# EAGLE design PATA Breakout Sequencer (EAGLE 9.3.1)
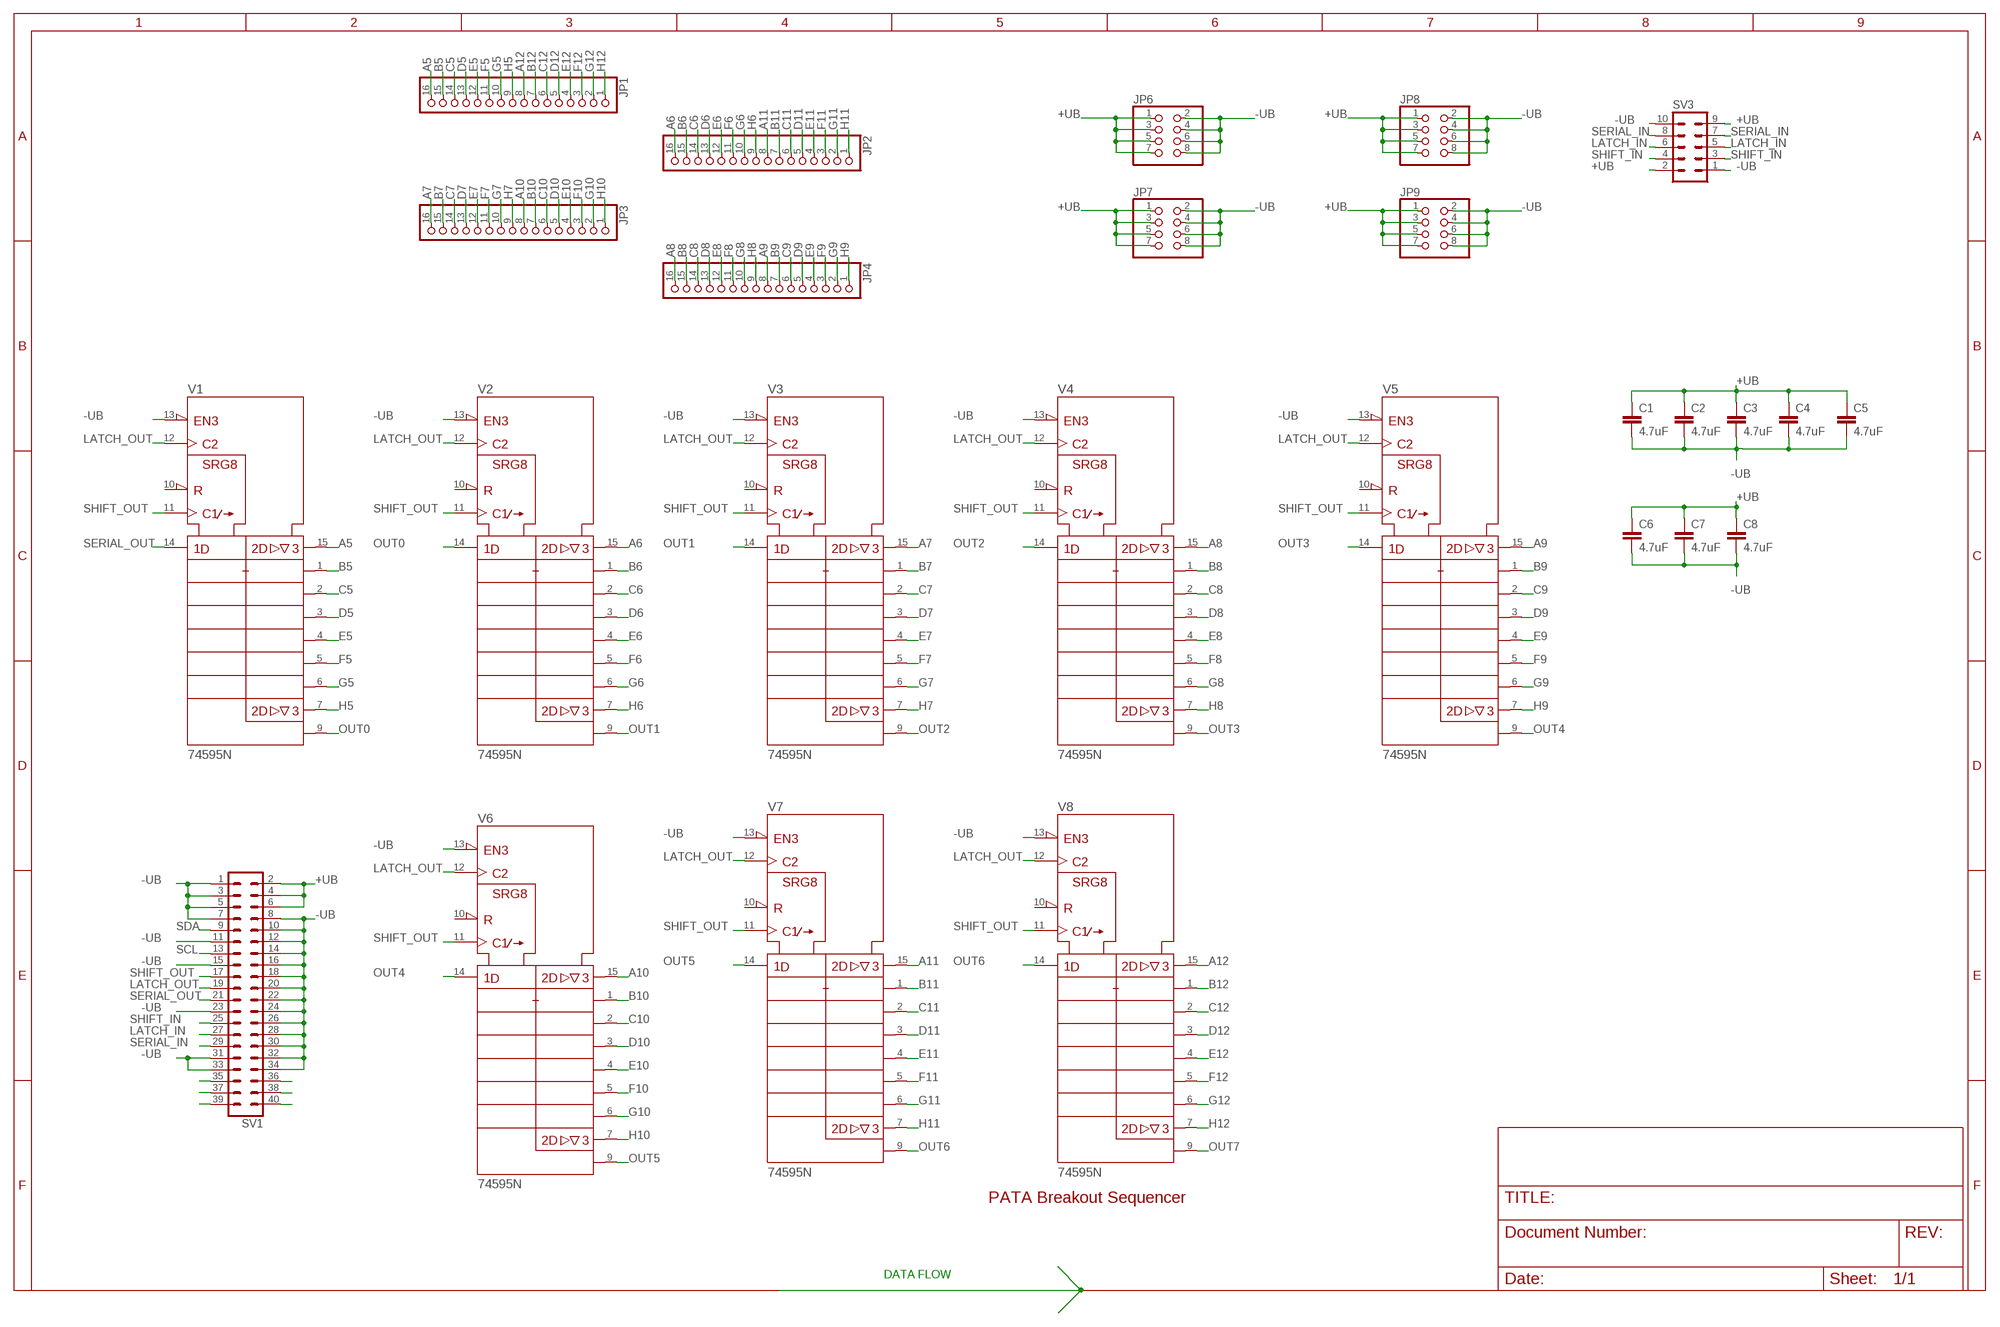
[diagram p0: schematic, sheet 1]

## Parts
C1  4.7uF  C-EU050-024X044  [C050-024X044]
C2  4.7uF  C-EU050-024X044  [C050-024X044]
C3  4.7uF  C-EU050-024X044  [C050-024X044]
C4  4.7uF  C-EU050-024X044  [C050-024X044]
C5  4.7uF  C-EU050-024X044  [C050-024X044]
C6  4.7uF  C-EU050-024X044  [C050-024X044]
C7  4.7uF  C-EU050-024X044  [C050-024X044]
C8  4.7uF  C-EU050-024X044  [C050-024X044]
JP1  PINHD-1X16  [1X16]
JP2  PINHD-1X16  [1X16]
JP3  PINHD-1X16  [1X16]
JP4  PINHD-1X16  [1X16]
JP6  PINHD-2X4  [2X04]
JP7  PINHD-2X4  [2X04]
JP8  PINHD-2X4  [2X04]
JP9  PINHD-2X4  [2X04]
SV1  MA20-2  [MA20-2]
SV3  MA05-2  [MA05-2]
V1  74595N  [DIL16]
V2  74595N  [DIL16]
V3  74595N  [DIL16]
V4  74595N  [DIL16]
V5  74595N  [DIL16]
V6  74595N  [DIL16]
V7  74595N  [DIL16]
V8  74595N  [DIL16]

## Nets
+UB: C1.1 C2.1 C3.1 C4.1 C5.1 C6.1 C7.1 C8.1 JP6.1 JP6.3 JP6.5 JP6.7 JP7.1 JP7.3 JP7.5 JP7.7 JP8.1 JP8.3 JP8.5 JP8.7 JP9.1 JP9.3 JP9.5 JP9.7 SV1.2 SV1.4 SV1.6 SV3.2 SV3.9
-UB: C1.2 C2.2 C3.2 C4.2 C5.2 C6.2 C7.2 C8.2 JP6.2 JP6.4 JP6.6 JP6.8 JP7.2 JP7.4 JP7.6 JP7.8 JP8.2 JP8.4 JP8.6 JP8.8 JP9.2 JP9.4 JP9.6 JP9.8 SV1.1 SV1.3 SV1.5 SV1.7 SV1.8 SV1.10 SV1.11 SV1.12 SV1.14 SV1.15 SV1.16 SV1.18 SV1.20 SV1.22 SV1.23 SV1.24 SV1.26 SV1.28 SV1.30 SV1.31 SV1.32 SV1.33 SV1.34 SV3.1 SV3.10 V1.13(!G) V2.13(!G) V3.13(!G) V4.13(!G) V5.13(!G) V6.13(!G) V7.13(!G) V8.13(!G)
A5: JP1.16 V1.15(QA)
A6: JP2.16 V2.15(QA)
A7: JP3.16 V3.15(QA)
A8: JP4.16 V4.15(QA)
A9: JP4.8 V5.15(QA)
A10: JP3.8 V6.15(QA)
A11: JP2.8 V7.15(QA)
A12: JP1.8 V8.15(QA)
B5: JP1.15 V1.1(QB)
B6: JP2.15 V2.1(QB)
B7: JP3.15 V3.1(QB)
B8: JP4.15 V4.1(QB)
B9: JP4.7 V5.1(QB)
B10: JP3.7 V6.1(QB)
B11: JP2.7 V7.1(QB)
B12: JP1.7 V8.1(QB)
C5: JP1.14 V1.2(QC)
C6: JP2.14 V2.2(QC)
C7: JP3.14 V3.2(QC)
C8: JP4.14 V4.2(QC)
C9: JP4.6 V5.2(QC)
C10: JP3.6 V6.2(QC)
C11: JP2.6 V7.2(QC)
C12: JP1.6 V8.2(QC)
D5: JP1.13 V1.3(QD)
D6: JP2.13 V2.3(QD)
D7: JP3.13 V3.3(QD)
D8: JP4.13 V4.3(QD)
D9: JP4.5 V5.3(QD)
D10: JP3.5 V6.3(QD)
D11: JP2.5 V7.3(QD)
D12: JP1.5 V8.3(QD)
E5: JP1.12 V1.4(QE)
E6: JP2.12 V2.4(QE)
E7: JP3.12 V3.4(QE)
E8: JP4.12 V4.4(QE)
E9: JP4.4 V5.4(QE)
E10: JP3.4 V6.4(QE)
E11: JP2.4 V7.4(QE)
E12: JP1.4 V8.4(QE)
F5: JP1.11 V1.5(QF)
F6: JP2.11 V2.5(QF)
F7: JP3.11 V3.5(QF)
F8: JP4.11 V4.5(QF)
F9: JP4.3 V5.5(QF)
F10: JP3.3 V6.5(QF)
F11: JP2.3 V7.5(QF)
F12: JP1.3 V8.5(QF)
G5: JP1.10 V1.6(QG)
G6: JP2.10 V2.6(QG)
G7: JP3.10 V3.6(QG)
G8: JP4.10 V4.6(QG)
G9: JP4.2 V5.6(QG)
G10: JP3.2 V6.6(QG)
G11: JP2.2 V7.6(QG)
G12: JP1.2 V8.6(QG)
H5: JP1.9 V1.7(QH)
H6: JP2.9 V2.7(QH)
H7: JP3.9 V3.7(QH)
H8: JP4.9 V4.7(QH)
H9: JP4.1 V5.7(QH)
H10: JP3.1 V6.7(QH)
H11: JP2.1 V7.7(QH)
H12: JP1.1 V8.7(QH)
LATCH_IN: SV1.27 SV3.5 SV3.6
LATCH_OUT: SV1.19 V1.12(RCK) V2.12(RCK) V3.12(RCK) V4.12(RCK) V5.12(RCK) V6.12(RCK) V7.12(RCK) V8.12(RCK)
N$18: SV1.35
N$19: SV1.37
N$20: SV1.39
N$38: SV1.36
N$39: SV1.38
N$40: SV1.40
OUT0: V1.9(QH*) V2.14(SER)
OUT1: V2.9(QH*) V3.14(SER)
OUT2: V3.9(QH*) V4.14(SER)
OUT3: V4.9(QH*) V5.14(SER)
OUT4: V5.9(QH*) V6.14(SER)
OUT5: V6.9(QH*) V7.14(SER)
OUT6: V7.9(QH*) V8.14(SER)
OUT7: V8.9(QH*)
SCL: SV1.13
SDA: SV1.9
SERIAL_IN: SV1.29 SV3.7 SV3.8
SERIAL_OUT: SV1.21 V1.14(SER)
SHIFT_IN: SV1.25 SV3.3 SV3.4
SHIFT_OUT: SV1.17 V1.11(SRCK) V2.11(SRCK) V3.11(SRCK) V4.11(SRCK) V5.11(SRCK) V6.11(SRCK) V7.11(SRCK) V8.11(SRCK)
Unconnected: V1.10(!SRCLR) V2.10(!SRCLR) V3.10(!SRCLR) V4.10(!SRCLR) V5.10(!SRCLR) V6.10(!SRCLR) V7.10(!SRCLR) V8.10(!SRCLR)

## Notes on the sheet
- DATA FLOW

## Power pins joined to a net without a drawn wire
+UB: V1.16(+UB) V2.16(+UB) V3.16(+UB) V4.16(+UB) V5.16(+UB) V6.16(+UB) V7.16(+UB) V8.16(+UB)
-UB: V1.8(-UB) V2.8(-UB) V3.8(-UB) V4.8(-UB) V5.8(-UB) V6.8(-UB) V7.8(-UB) V8.8(-UB)

## Library data of the parts
C1-C8 = rcl:C-EU: CAPACITOR, European symbol; SPICEPREFIX: C
JP1-JP4 = pinhead:PINHD-1X16: PIN HEADER
JP6-JP9 = pinhead:PINHD-2X4: PIN HEADER
SV1 = con-lstb:MA20-2: PIN HEADER; OC_FARNELL: unknown; OC_NEWARK: unknown
SV3 = con-lstb:MA05-2: PIN HEADER; OC_FARNELL: unknown; OC_NEWARK: unknown
V1-V8 = 74ttl-din:74*595: 8-bit SHIFT REGISTER, output latch

## Board
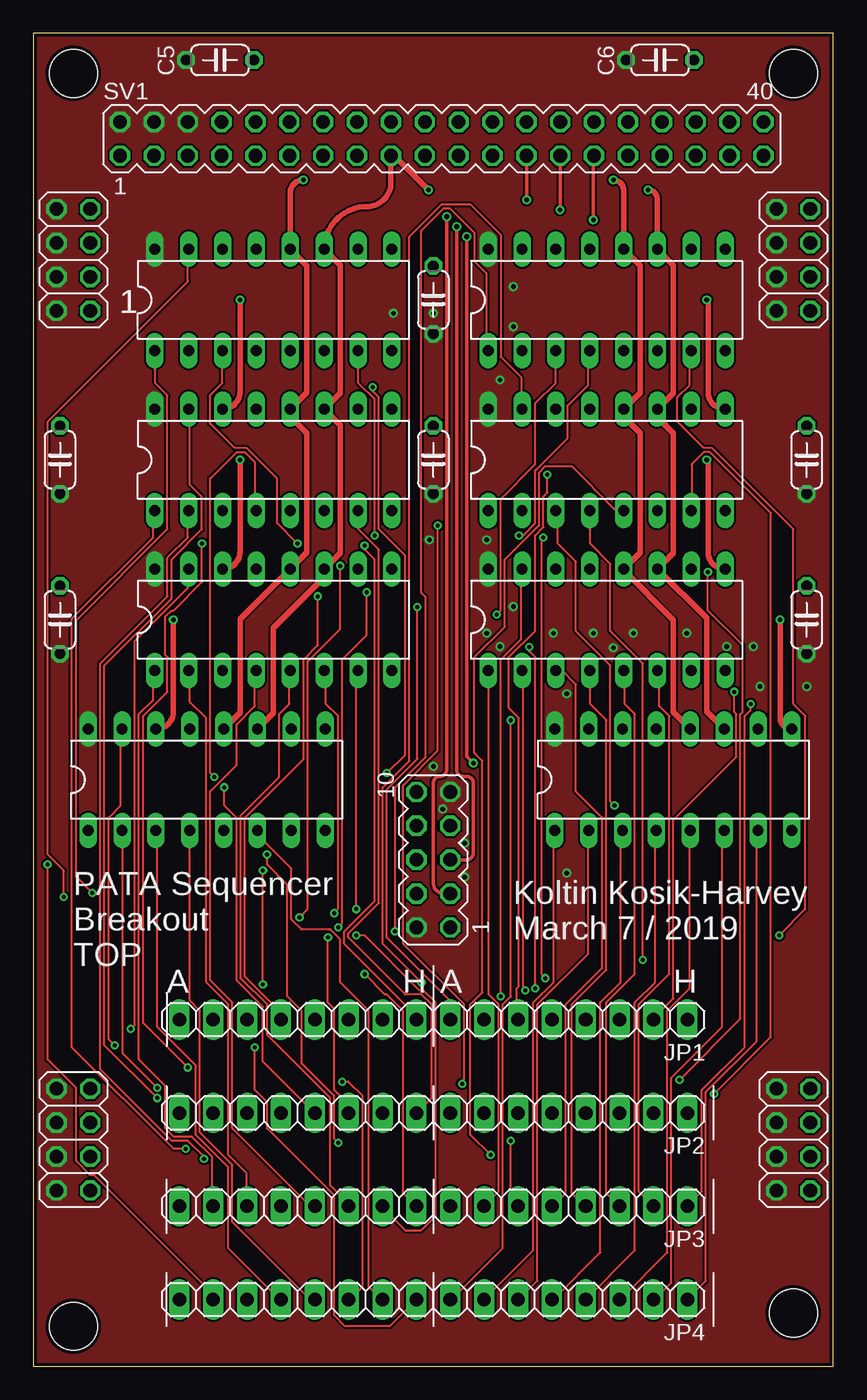
[diagram p1: board, top side]
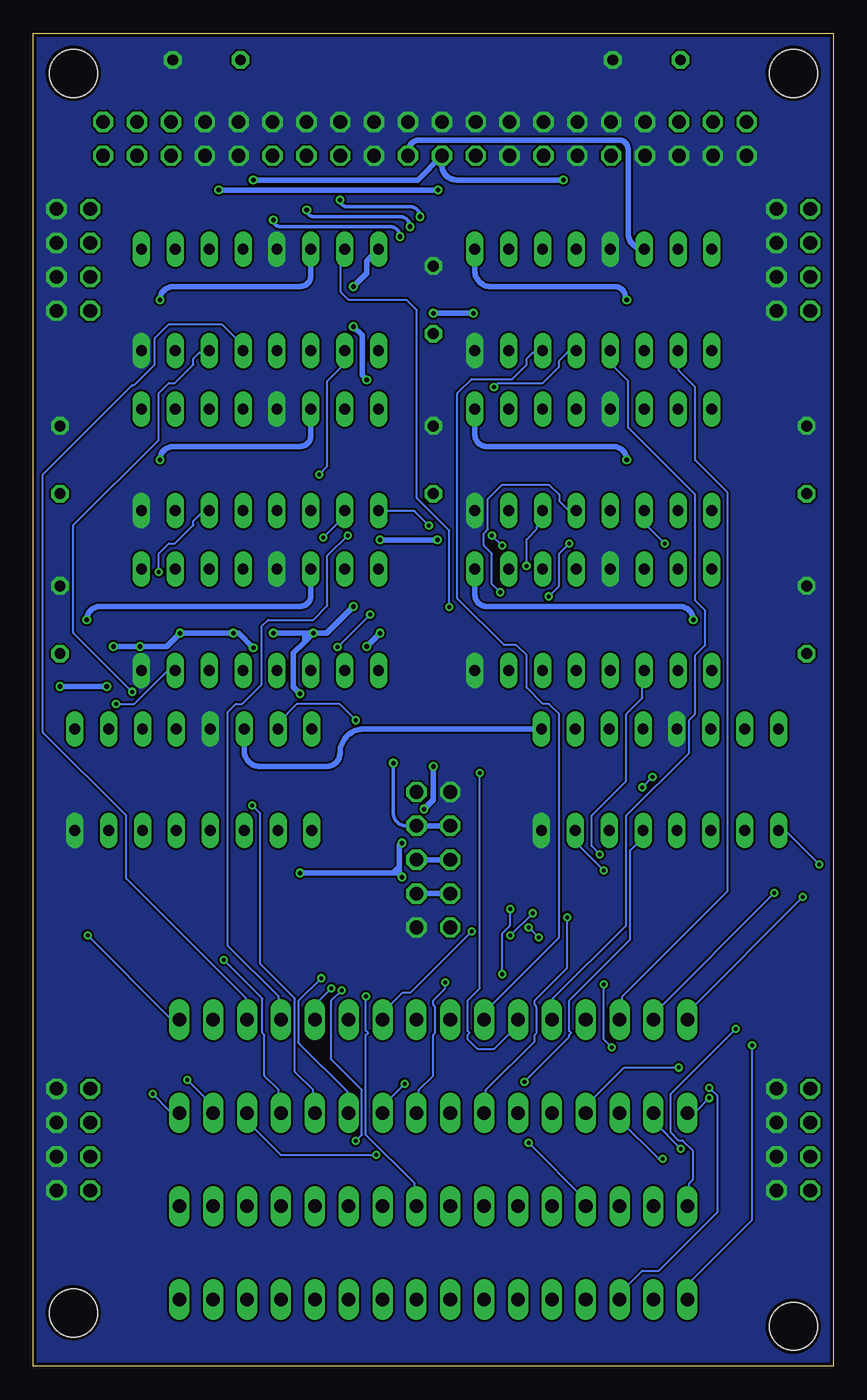
[diagram p2: board, bottom side, seen from below]

Size 60 x 100 mm. Coordinates in mm from the lower left corner, seen from the top.
Outline: 0,0 60,0 60,100 0,100 0,0
Copper layers (1*16): Top 0.035mm / dielectric 1.5mm / Bottom 0.035mm
Design rules "SeeedStudio_2layer_DRU_no_angle_20140221": minimum track width 6mil, minimum drill 12mil, track to track 6mil, track to pad 6mil, pad to pad 6mil, via to via 6mil, smd to smd 0mil, copper to edge 10mil, drill to drill 10mil, minimum pad ring 10mil, minimum via ring 6mil, stop-mask expansion 2mil, vias tented up to drill 100mil, thermal gap 10mil
Holes 3.6 mm at 3,97 3,3 57,4 57,97

### Footprints (pad centres in the part's own frame; a part is rotated, then mirrored left to right if it is on the bottom)
C050-024X044 = drill 0.813 octagon: 1 -2.54,0; 2 2.54,0
1X16 = drill 1.016 long: 1 -19.05,0; 2 -16.51,0; 3 -13.97,0; 4 -11.43,0; 5 -8.89,0; 6 -6.35,0; 7 -3.81,0; 8 -1.27,0; 9 1.27,0; 10 3.81,0; 11 6.35,0; 12 8.89,0; 13 11.43,0; 14 13.97,0; 15 16.51,0; 16 19.05,0
2X04 = drill 1.016 octagon: 1 -3.81,-1.27; 2 -3.81,1.27; 3 -1.27,-1.27; 4 -1.27,1.27; 5 1.27,-1.27; 6 1.27,1.27; 7 3.81,-1.27; 8 3.81,1.27
MA20-2 = drill 1.016 octagon: 1 -24.13,-1.27; 2 -24.13,1.27; 3 -21.59,-1.27; 4 -21.59,1.27; 5 -19.05,-1.27; 6 -19.05,1.27; 7 -16.51,-1.27; 8 -16.51,1.27; 9 -13.97,-1.27; 10 -13.97,1.27; 11 -11.43,-1.27; 12 -11.43,1.27; 13 -8.89,-1.27; 14 -8.89,1.27; 15 -6.35,-1.27; 16 -6.35,1.27; 17 -3.81,-1.27; 18 -3.81,1.27; 19 -1.27,-1.27; 20 -1.27,1.27; 21 1.27,-1.27; 22 1.27,1.27; 23 3.81,-1.27; 24 3.81,1.27; 25 6.35,-1.27; 26 6.35,1.27; 27 8.89,-1.27; 28 8.89,1.27; 29 11.43,-1.27; 30 11.43,1.27; 31 13.97,-1.27; 32 13.97,1.27; 33 16.51,-1.27; 34 16.51,1.27; 35 19.05,-1.27; 36 19.05,1.27; 37 21.59,-1.27; 38 21.59,1.27; 39 24.13,-1.27; 40 24.13,1.27
MA05-2 = drill 1.016 octagon: 1 -5.08,-1.27; 2 -5.08,1.27; 3 -2.54,-1.27; 4 -2.54,1.27; 5 0,-1.27; 6 0,1.27; 7 2.54,-1.27; 8 2.54,1.27; 9 5.08,-1.27; 10 5.08,1.27
DIL16 = drill 0.813 long: 1 -8.89,-3.81; 2 -6.35,-3.81; 3 -3.81,-3.81; 4 -1.27,-3.81; 5 1.27,-3.81; 6 3.81,-3.81; 7 6.35,-3.81; 8 8.89,-3.81; 9 8.89,3.81; 10 6.35,3.81; 11 3.81,3.81; 12 1.27,3.81; 13 -1.27,3.81; 14 -3.81,3.81; 15 -6.35,3.81; 16 -8.89,3.81

### Placement (x,y rotation side)
C1  2,68 90 top
C2  2,56 90 top
C3  58,68 90 top
C4  58,56 90 top
C5  14,98 0 top
C6  47,98 0 top
C7  30,80 90 top
C8  30,68 90 top
JP1  30,26 180 top
JP2  30,19 180 top
JP3  30,12 180 top
JP4  30,5 180 top
JP6  3,17 270 top
JP7  57,17 270 top
JP8  3,83 270 top
JP9  57,83 270 top
SV1  30.63,92.09 0 top
SV3  30,38 90 top
V1  18,80 0 top
V2  18,68 0 top
V3  18,56 0 top
V4  13,44 0 top
V5  48,44 0 top
V6  43,56 0 top
V7  43,68 0 top
V8  43,80 0 top

### Tracks (layer width: path | path; a pad name or v marks a point on that pad's centre or on a via)
+UB  (via drill 0.35)
  Bottom 0.406: v30,45 30,42.5 v30.7,41.8 | v27,79 v30,79 | v29.7,62 v34,62 | v34,55 v35,54 | v36,57 38,55 v39,55 | v35,74 35.35,74.35 35.35,77.35 v36,78 | V8.16 35,82.92 35,82 v36,81 | v40,50.45 40.5,50.95 40.5,53.5 39.65,54.35 | v39,55 39.65,54.35 | v39,55 39.65,55 | 39.65,55 v42,55 | 39.65,54.35 39.65,55 | v43.5,53.9 44.6,55 v45,55 v49,55 50,54 v52,54 v54,54 | v54.5,51 v58,51 | v32.35,39.25 32.4,39.25 32.54,39.11 32.54,37.45 | 32.54,37 32.54,37.45 | v40,37 33,37 | 33,37 32.54,37 | v32.35,36.7 32.54,36.89 32.54,37 | 33,37 32.55,37.45 32.54,37.45
  pour Top (no thermals): -2,102 62,102 62,-2 -2,-2
-UB
  pour Bottom (no thermals): -1,101 61,101 61,-1 -1,-1
A5  (via drill 0.3)
  Top 0.152: v2.29,35.2 2.29,37.19 1.07,38.41 1.07,70.87 11.58,81.38 11.58,83.67 V1.15
  Bottom 0.152: v2.29,35.2 10.82,26.67 10.82,26.06 JP1.16
A6  (via drill 0.3)
  Top 0.152: v9.3,20.12 5.33,24.08 5.33,52.58 10.36,57.61 10.36,60.5 12.65,62.79 12.65,65.23 11.73,66.14 11.73,71.78 V2.15
  Bottom 0.152: v9.3,20.12 10.36,19.05 10.82,19.05 JP2.16
A7  (via drill 0.3)
  Top 0.152: v7.32,25.3 7.62,25.6 7.62,54.41 11.58,58.37 11.58,59.74 V3.15
  Bottom 0.152: v7.32,25.3 12.19,20.42 12.19,17.53 11.58,16.92 11.28,16.92 10.52,16.15 10.52,14.02 10.82,13.72 10.82,12.04 JP3.16
A8  (via drill 0.3)
  Top 0.152: v6.1,24.08 5.64,24.54 5.64,41.15 6.55,42.06 6.55,47.7 V4.15
  Bottom 0.152: v6.1,24.08 6.1,10.97 10.82,6.25 10.82,5.03 JP4.16
A9  (via drill 0.3)
  Top 0.152: v35.81,48.46 35.81,27.74 35.2,27.13 35.2,8.84 31.39,5.03 JP4.8
  Bottom 0.152: v35.81,48.46 37.03,49.68 40.23,49.68 41.6,48.31 41.6,47.85 V5.15
A10  (via drill 0.3)
  Top 0.152: v35.05,27.74 35.05,53.03 36.58,54.56 36.58,59.74 V6.15
  Bottom 0.152: v35.05,27.74 35.05,25.15 34.9,24.99 35.05,24.84 35.05,17.37 31.39,13.72 31.39,12.04 JP3.8
A11  (via drill 0.3)
  Top 0.152: v29.11,28.8 26.21,31.7 26.21,43.43 28.19,45.41 28.19,84.73 30.63,87.17 32.77,87.17 35.05,84.89 35.05,75.74 36.58,74.22 36.58,71.93 V7.15
  Bottom 0.152: v29.11,28.8 29.11,28.35 30.02,27.43 30.02,27.13 29.87,26.98 29.87,24.99 30.02,24.84 30.02,21.79 31.09,20.73 31.09,19.2 31.24,19.05 JP2.8
A12  (via drill 0.3)
  Top 0.152: v28.8,56.97 28.8,45.57 26.52,43.28 26.52,32.16 31.24,27.43 31.24,26.06 JP1.8
  Bottom 0.152: v28.8,56.97 28.8,62.7 31.24,65.14 31.24,79.24 32,80 36.35,80 36.98,80.63 36.98,83.48 V8.15
B5  (via drill 0.3)
  Top 0.152: v4.42,35.51 3.2,36.73 3.2,55.93 10.06,62.79 10.06,72.85 9.14,73.76 9.14,76.05 V1.1
  Bottom 0.152: v4.42,35.51 13.41,26.52 13.41,26.06 JP1.15
B6  (via drill 0.3)
  Top 0.152: v11.43,16.31 10.52,16.31 2.9,23.93 2.9,56.08 8.99,62.18 8.99,64.16 V2.1
  Bottom 0.152: v11.43,16.31 13.41,18.29 13.41,18.9 JP2.15
B7
  Top 0.152: V3.1 8.99,52.12 8.99,49.99 7.92,48.92 7.92,23.01 9.91,21.03 9.91,17.83 10.52,17.22 11.89,17.22 13.41,15.7 13.41,12.04 JP3.15
B8  (via drill 0.3)
  Top 0.152: v1.07,37.64 1.07,23.01 3.2,20.88 3.2,15.39 4.27,14.33 4.57,14.33 13.41,5.49 13.41,5.03 JP4.15
  Bottom 0.152: v1.07,37.64 3.5,40.08 3.96,40.08 V4.1
B9
  Top 0.152: V5.1 39.01,40.08 39.01,28.8 37.49,27.28 37.49,8.69 33.83,5.03 JP4.7
B10
  Top 0.152: V6.1 34.14,52.12 34.14,27.89 34.9,27.13 34.9,13.11 33.83,12.04 JP3.7
B11  (via drill 0.3)
  Top 0.152: v30.33,63.06 30.33,46.18 27.74,43.59 27.74,31.7 32.31,27.13 32.31,21.34 v32.16,21.18
  Bottom 0.152: v30.33,63.06 31.43,64.16 33.98,64.16 V7.1 | v32.16,21.18 33.68,19.66 33.68,19.05 JP2.7
B12  (via drill 0.3)
  Top 0.152: v27.13,32.61 27.13,43.43 29.41,45.72 29.41,57.72 29.11,58.02 29.11,85.19 30.79,86.87 31.24,86.87 33.07,85.04 33.07,82.91 33.98,81.99 33.98,76.2 V8.1
  Bottom 0.152: v27.13,32.61 31.7,28.04 32.31,28.04 33.68,26.67 33.68,26.06 JP1.7
C5
  Bottom 0.152: V1.2 11.58,76.05 11.58,74.68 10.36,73.46 10.36,67.97 7.92,65.53 7.92,35.66 15.85,27.74 15.85,27.58 16,27.43 16,26.06 JP1.14
C6  (via drill 0.3)
  Top 0.152: v12.8,15.54 12.8,15.7 11.58,16.92 10.36,16.92 5.03,22.25 5.03,52.73 10.06,57.76 10.06,60.66 11.58,62.18 11.58,64.16 V2.2
  Bottom 0.152: v12.8,15.54 13.11,15.54 16,18.44 16,18.9 JP2.14
C7
  Top 0.152: V3.2 11.73,52.12 11.73,49.84 12.95,48.62 12.95,28.8 14.63,27.13 14.63,15.85 16,14.48 16,12.04 JP3.14
C8  (via drill 0.3)
  Top 0.152: v9.3,20.88 6.71,23.47 6.71,40.08 V4.2
  Bottom 0.152: v9.3,20.88 8.69,20.27 8.69,11.58 13.11,7.16 14.33,7.16 16,5.49 16,5.03 JP4.14
C9
  Top 0.152: V5.2 41.6,40.08 41.6,30.94 37.8,27.13 37.8,6.4 36.42,5.03 JP4.6
C10  (via drill 0.3)
  Top 0.152: v36.88,28.19 36.73,28.35 36.73,52.12 V6.2 | v35.81,16.92 35.81,12.5 36.27,12.04 JP3.6
  Bottom 0.152: v36.88,28.19 37.64,27.43 37.64,27.13 37.64,27.12 37.64,24.84 37.64,23.01 35.36,20.73 35.36,17.37 v35.81,16.92
C11  (via drill 0.3)
  Top 0.152: v38.25,62.18 38.1,62.03 38.1,29.41 v38.41,29.11
  Bottom 0.152: v38.25,62.18 36.73,63.7 36.73,64.16 V7.2 | v38.41,29.11 40.08,27.43 40.08,24.23 36.42,20.57 36.42,19.05 JP2.6
C12  (via drill 0.3)
  Top 0.152: v38.56,66.9 38.56,65.53 38.25,65.23 38.25,62.94 37.64,62.33 37.64,55.17 35.66,53.19 35.66,49.38 36.42,48.62 36.42,28.5 36.27,28.35 36.27,26.06 JP1.6
  Bottom 0.152: v38.56,66.9 37.95,67.51 37.95,73.91 36.73,75.13 36.73,76.05 V8.2
D5  (via drill 0.3)
  Top 0.152: v19.81,61.72 18.29,63.25 18.29,66.6 16,68.89 15.09,68.89 13.26,70.71 13.26,72.85 14.17,73.76 14.17,76.05 V1.3 | v21.34,57.76 21.34,54.1 20.27,53.03 20.27,45.57 15.85,41.15 15.85,29.26 18.44,26.67 18.44,26.06 JP1.13
  Bottom 0.152: v19.81,61.72 20.57,60.96 20.57,58.52 v21.34,57.76
D6  (via drill 0.3)
  Top 0.152: v12.65,61.72 12.65,58.83 10.52,56.69 10.36,56.69 9.91,56.24 9.91,53.34 10.06,53.19 10.06,50.6 8.23,48.77 8.23,25.76 v11.58,22.4
  Bottom 0.152: v12.65,61.72 14.17,63.25 14.17,64.16 V2.3 | v11.58,22.4 15.7,22.4 18.44,19.66 18.44,19.05 JP2.13
D7  (via drill 0.3)
  Top 0.152: v17.53,38.41 17.53,37.64 19.05,36.12 19.05,27.74 20.12,26.67 20.12,22.71 22.55,20.27 22.55,17.07 v22.86,16.76
  Bottom 0.152: v17.53,38.41 18.14,39.01 18.14,41.3 15.54,43.89 15.54,48.92 14.33,50.14 14.33,52.12 V3.3 | v22.86,16.76 18.59,12.5 18.59,12.04 JP3.13
D8
  Top 0.152: V4.3 9.3,40.08 9.3,25.45 12.19,22.55 12.19,17.37 14.63,14.94 14.63,8.84 18.44,5.03 JP4.13
D9
  Top 0.152: V5.3 44.04,40.08 44.04,28.8 42.52,27.28 42.52,8.53 39.01,5.03 JP4.5
D10
  Top 0.152: V6.3 39.66,52.19 40.69,51.16 40.69,43.13 42.67,41.15 42.67,29.87 39.93,27.13 39.93,12.95 39.01,12.04 JP3.5
D11  (via drill 0.3)
  Top 0.152: v43.59,42.06 43.28,42.37 43.28,52.58 40.69,55.17 40.69,60.35 39.32,61.72 39.32,64.16 V7.3
  Bottom 0.152: v43.59,42.06 42.98,41.45 42.98,30.18 40.39,27.58 40.39,22.1 39.01,20.73 39.01,19.05 JP2.5
D12  (via drill 0.3)
  Top 0.152: v34.75,56.39 35.05,56.69 35.05,65.08 37.64,67.67 37.64,72.24 39.17,73.76 39.17,76.05 V8.3 | v37.19,53.95 37.19,53.65 37.64,53.19 v37.64,28.35
  Bottom 0.152: v37.19,53.95 v34.75,56.39 | v37.64,28.35 38.86,27.13 38.86,26.06 JP1.5
E5
  Bottom 0.152: V1.4 16.61,76.05 16.61,75.13 15.39,73.91 15.39,70.41 10.36,65.38 10.36,57.45 9.6,56.69 9.6,54.1 10.36,53.34 10.36,48.92 10.82,48.46 10.82,46.02 15.54,41.3 15.54,33.07 21.03,27.58 21.03,26.06 JP1.12
E6  (via drill 0.3)
  Top 0.152: v13.56,44.2 13.26,44.5 13.26,66.6 15.24,68.58 15.85,68.58 16.61,67.82 16.61,64.31 V2.4 | v14.33,43.43 14.33,42.06 15.24,41.15 15.24,28.96 17.22,26.98 17.22,22.86 21.03,19.05 JP2.12
  Bottom 0.152: v14.33,43.43 v13.56,44.2
E7
  Top 0.152: V3.4 16.61,52.12 16.61,49.53 15.24,48.16 15.24,45.11 13.26,43.13 13.26,28.96 14.94,27.28 14.94,17.83 20.73,12.04 21.03,12.04 JP3.12
E8
  Top 0.152: V4.4 11.73,40.08 11.73,27.43 12.5,26.67 12.5,17.53 14.94,15.09 14.94,10.82 20.73,5.03 21.03,5.03 JP4.12
E9
  Top 0.152: V5.4 46.63,40.08 46.63,28.8 45.11,27.28 45.11,8.69 41.45,5.03 JP4.4
E10
  Top 0.152: V6.4 41.76,52.12 41.76,49.68 42.98,48.46 42.98,29.72 40.39,27.13 40.39,12.95 41.3,12.04 JP3.4
E11  (via drill 0.3)
  Top 0.152: v45.72,30.48 45.72,52.73 43.28,55.17 43.28,60.2 41.76,61.72 41.76,64.16 V7.4
  Bottom 0.152: v45.72,30.48 42.82,27.58 42.82,24.99 42.67,24.84 42.67,21.79 41.6,20.73 41.6,19.2 41.45,19.05 JP2.4
E12  (via drill 0.3)
  Top 0.152: v36.42,62.33 36.73,62.33 37.64,63.25 37.64,67.21 40.08,69.65 40.08,72.08 41.6,73.61 41.6,76.05 V8.4
  Bottom 0.152: v36.42,62.33 37.95,60.81 37.95,57.05 39,56 42.4,56 42.88,55.52 42.88,51.15 44.35,49.68 44.81,49.68 45.41,49.07 45.41,31.55 41.6,27.74 41.6,27.58 41.45,27.43 41.45,26.06 JP1.4
F5  (via drill 0.3)
  Top 0.152: v25.45,73.46 25.45,73.15 25.91,72.69 25.91,62.79 27.89,60.81 27.89,45.87 v26.52,44.5
  Bottom 0.152: v25.45,73.46 25.15,73.76 21.79,73.76 20.57,74.98 20.57,75.44 19.96,76.05 19.36,76.05 V1.5 | v26.52,44.5 26.52,28.35 27.43,27.43 27.43,25.15 27.28,24.99 27.43,24.84 27.43,24.54 26.67,23.77 25.45,23.77 23.77,25.45 23.77,25.91 JP1.11
F6  (via drill 0.3)
  Top 0.152: v24.99,58.06 24.99,54.86 23.16,53.03 23.16,33.22 v22.86,32.92 | v22.1,32.16 22.1,27.28 22.55,26.82 22.55,20.73 23.62,19.66 23.62,19.05 JP2.11
  Bottom 0.152: v24.99,58.06 25.6,58.67 25.6,60.96 26.21,61.57 26.21,62.48 25.91,62.79 25.91,65.08 24.84,66.14 21.34,66.14 20.57,65.38 20.57,64.92 19.96,64.31 19.36,64.31 V2.5 | v22.1,32.16 v22.86,32.92
F7
  Top 0.152: V3.5 19.2,52.12 19.2,49.68 18.44,48.92 18.44,44.2 15.54,41.3 15.54,29.11 17.53,27.13 17.53,24.84 22.25,20.12 22.25,13.56 23.77,12.04 JP3.11
F8  (via drill 0.3)
  Top 0.152: v23.16,21.34 23.62,21.34 24.69,20.27 24.69,5.94 23.77,5.03 JP4.11
  Bottom 0.152: v23.16,21.34 19.81,24.69 19.81,24.84 19.66,24.99 19.81,25.15 19.81,27.43 15.24,32 15.24,38.71 14.33,39.62 14.33,40.08 V4.5
F9
  Top 0.152: V5.5 49.23,40.08 49.23,28.35 47.55,26.67 47.55,8.53 44.04,5.03 JP4.3
F10
  Top 0.152: V6.5 44.35,52.12 44.35,49.68 45.11,48.92 45.11,29.41 42.98,27.28 42.98,12.95 43.89,12.04 JP3.3
F11  (via drill 0.3)
  Top 0.152: v34.29,15.85 32.77,17.37 32.77,27.13 33.68,28.04 33.68,45.41 33.07,46.02 33.07,53.19 35.36,55.47 35.36,60.5 37.95,63.09 37.95,67.06 38.41,67.51 40.39,67.51 43.59,64.31 44.2,64.31 V7.5
  Bottom 0.152: v34.29,15.85 41.45,15.85 43.89,18.29 43.89,18.9 JP2.3
F12
  Bottom 0.152: V8.5 44.35,76.2 44.35,76.66 45.87,78.18 49.84,78.18 50.9,77.11 50.9,75.13 52.43,73.61 52.58,73.61 59.28,66.9 59.28,47.55 53.03,41.3 53.03,36.58 44.04,27.58 44.04,26.06 JP1.3
G5
  Bottom 0.152: V1.6 21.95,76.05 22.55,76.05 23.01,75.59 23.01,75.13 24.08,74.07 27.13,74.07 28.19,73 28.19,57.61 24.69,54.1 23.77,54.1 23.01,53.34 23.01,50.9 21.79,49.68 21.34,49.68 20.57,48.92 20.57,32.16 26.06,26.67 26.06,26.06 JP1.10
G6  (via drill 0.3)
  Top 0.152: v23.01,60.05 23.01,55.32 20.57,52.88 20.57,34.29 v19.96,33.68
  Bottom 0.152: v23.01,60.05 23.01,62.03 22.25,62.79 22.25,62.94 21.95,63.25 21.95,64.16 V2.6 | v19.96,33.68 19.96,29.87 22.4,27.43 22.4,27.13 22.25,26.98 22.25,24.99 22.4,24.84 22.4,24.38 26.06,20.73 26.06,19.05 JP2.10
G7  (via drill 0.3)
  Top 0.152: v22.55,33.98 22.86,34.29 22.86,48.77 21.95,49.68 21.95,52.12 V3.6 | v24.23,32.31 24.84,32.31 28.96,28.19 29.26,28.19 30.18,27.28 30.18,11.28 29.11,10.21 27.89,10.21 26.21,11.89 JP3.10
  Bottom 0.152: v24.23,32.31 v22.55,33.98
G8
  Top 0.152: V4.6 16.92,40.08 16.92,39.78 19.36,37.34 19.36,33.53 20.12,32.77 22.25,32.77 23.01,32 23.01,28.8 25.15,26.67 25.15,5.94 26.06,5.03 JP4.10
G9
  Top 0.152: V5.6 51.66,40.08 51.66,25.45 47.85,21.64 47.85,6.25 46.63,5.03 JP4.2
G10
  Top 0.152: V6.6 46.94,52.12 46.94,49.53 47.7,48.77 47.7,29.41 45.41,27.13 45.41,13.11 46.48,12.04 JP3.2
G11  (via drill 0.3)
  Top 0.152: v50.6,59.59 50.6,56.69 53.19,54.1 53.19,49.07 53.03,48.92 53.03,26.06 v48.46,21.49
  Bottom 0.152: v50.6,59.59 50.6,60.96 49.84,61.72 49.38,61.72 48.01,63.09 48.01,63.4 47.24,64.16 46.94,64.16 V7.6 | v48.46,21.49 46.63,19.66 46.63,19.05 JP2.2
G12  (via drill 0.3)
  Top 0.152: v52.58,50.6 52.58,49.07 52.73,48.92 52.73,45.72 48.01,41 48.01,27.58 46.48,26.06 JP1.2
  Bottom 0.152: v52.58,50.6 57,55.02 57,63.09 50.6,69.49 50.6,73 49.84,73.76 49.38,73.76 48.01,75.13 48.01,75.59 47.55,76.05 46.94,76.05 V8.6
H5  (via drill 0.3)
  Top 0.152: v25.6,62.33 25.6,72.54 24.38,73.76 24.38,76.05 V1.7 | v24.84,61.57 24.84,61.27 25.6,60.5 25.6,34.9 23.32,32.61 23.32,31.7 28.65,26.36 28.65,26.06 JP1.9
  Bottom 0.152: v24.84,61.57 v25.6,62.33
H6
  Top 0.152: V2.7 24.38,64.16 24.38,62.79 25.91,61.27 25.91,34.75 23.62,32.46 23.62,32.16 27.89,27.89 29.11,27.89 29.87,27.13 29.87,20.12 28.8,19.05 JP2.9
H7  (via drill 0.3)
  Top 0.152: v24.23,34.29 24.23,52.12 V3.7 | v24.84,29.41 26.36,27.89 26.52,27.89 27.74,26.67 27.74,12.95 28.65,12.04 JP3.9
  Bottom 0.152: v24.23,34.29 24.23,33.07 24.84,32.46 v24.84,29.41
H8  (via drill 0.3)
  Top 0.152: v17.22,28.65 v17.22,37.19 | v16.61,23.93 16.61,20.73 17.53,19.81 17.53,17.83 22.55,12.8 22.55,3.81 23.36,3 26.73,3 JP4.9
  Bottom 0.152: v17.22,37.19 19.2,39.17 19.2,40.08 V4.7 | v17.22,28.65 17.22,24.54 v16.61,23.93
H9
  Top 0.152: V5.7 54.25,40.08 54.25,24.38 50.44,20.57 50.44,6.4 49.07,5.03 JP4.1
H10  (via drill 0.3)
  Top 0.152: v53.8,49.68 53.8,49.23 53.34,48.77 53.34,23.93 50.14,20.73 50.14,13.11 49.07,12.04 JP3.1
  Bottom 0.152: v53.8,49.68 52.43,49.68 49.99,52.12 49.38,52.12 V6.7
H11  (via drill 0.3)
  Top 0.152: v51.05,20.42 55.32,24.69 55.32,64.01 50.75,68.58 50.29,68.58 49.38,67.67 49.38,64.31 V7.7
  Bottom 0.152: v51.05,20.42 49.68,19.05 49.07,19.05 JP2.1
H12  (via drill 0.3)
  Top 0.152: v55.93,32.31 57.91,34.29 57.91,48.77 57,49.68 57,62.79 50.9,68.89 50.29,68.89 48.31,70.87 48.31,72.69 49.23,73.61 49.23,76.05 V8.7
  Bottom 0.152: v55.93,32.31 49.68,26.06 49.07,26.06 JP1.1
LATCH_IN  (via drill 0.35)
  Top 0.254: SV1.27 arc90 39.5,90.8 v39.5,86.75 | v31.75,85.5 31.75,44.75 arc90 32.25,44.25 32.5,44.25 arc-90 33,43.75 33,38.5 arc-90 32.5,38 SV3.5
  Bottom 0.254: v39.5,86.75 arc-90 39,86.25 32.5,86.25 arc90 v31.75,85.5
  Bottom 0.406: SV3.6 SV3.5
LATCH_OUT  (via drill 0.35)
  Top 0.406: V4.12 15.5,49.04 15.5,56.04 V3.12 20.5,61.04 20.5,70 19.27,71.23 V2.12 20.5,73.04 20.5,82.58 V1.12 19.27,88.02 arc-90 v20.25,89 | V5.12 48,49.08 48,56 44.27,59.73 V6.12 45.5,61.04 45.5,70 44.27,71.23 V7.12 45.5,73.04 45.5,82.58 V8.12 44.27,88.23 arc90 v43.5,89
  Bottom 0.406: v43.5,89 31.18,89 SV1.19 29.36,90.11 arc-90 28.25,89 v20.25,89
OUT0  (via drill 0.35)
  Top 0.406: v15.5,80 15.5,73.12 arc-90 V2.14
  Bottom 0.406: V1.9 26.89,82.19 arc-90 25.7,81 16.4,81 arc90 15.6,80.2 15.6,80.1 arc-90 v15.5,80
OUT1  (via drill 0.35)
  Top 0.406: v15.5,68 15.5,61.12 arc-90 V3.14
  Bottom 0.406: V2.9 26.89,69.89 arc-90 26,69 16.5,69 arc90 v15.5,68
OUT2  (via drill 0.35)
  Top 0.406: v10.5,56 10.5,49.12 arc-90 V4.14
  Bottom 0.406: V3.9 26.89,57.89 arc-90 26,57 11.5,57 arc90 v10.5,56
OUT3
  Bottom 0.406: V4.9 35.19,47.81 arc-90 37,46 arc90 38,45 43,45 arc90 44.19,46.19 V5.14
OUT4  (via drill 0.35)
  Top 0.406: v56,56 56,48.7 arc90 V5.9
  Bottom 0.406: V6.14 39.19,57.81 arc90 40,57 55,57 arc-90 v56,56
OUT5  (via drill 0.35)
  Top 0.406: v50.5,68 50.6,67.9 50.6,61.1 arc90 V6.9
  Bottom 0.406: V7.14 39.19,69.81 arc90 40,69 49.5,69 arc-90 v50.5,68
OUT6  (via drill 0.35)
  Top 0.406: v50.5,80 50.6,79.9 50.6,73.1 arc90 V7.9
  Bottom 0.406: V8.14 39.19,81.81 arc90 40,81 49.5,81 arc-90 v50.5,80
SERIAL_IN  (via drill 0.35)
  Top 0.254: 42,90.76 v42,86 | v32.5,84.75 32.5,45.75 v33,45.25
  Top 0.406: SV1.29 42,90.76
  Bottom 0.254: v42,86 arc-90 41.5,85.5 33.25,85.5 arc90 v32.5,84.75 | SV3.7 32.04,40.54 arc90 33,41.5 v33,45.25
  Bottom 0.406: SV3.8 SV3.7
SERIAL_OUT
  Bottom 0.406: SV1.21 31.9,91.1 arc90 31,92 16.1,92 arc90 15.4,91.3 15.4,85.02 arc-90 V1.14
SHIFT_IN  (via drill 0.35)
  Top 0.254: SV1.25 arc-90 37,90.8 v37,87.5 | v31,86.25 31,44.75 arc-90 30.5,44.25 arc90 30,43.75 30,36.25 arc90 30.79,35.46 SV3.3
  Bottom 0.254: v37,87.5 arc-90 36.5,87 31.75,87 arc90 v31,86.25
  Bottom 0.406: SV3.4 SV3.3
SHIFT_OUT  (via drill 0.35)
  Top 0.406: V4.11 18,49 18,55.4 21.81,59.21 V3.11 23,61 23,70.62 V2.11 23,73 23,82.62 V1.11 arc-90 25,87 arc90 26.82,88.82 SV1.17 27.07,90.82 v29.64,88.25 | v46.1,88.25 arc-90 46.8,87.55 V8.11 48,82.62 48,73 V7.11 46.81,71.19 48,70 48,61 V6.11 50.5,56.12 50.5,49.12 V5.11
  Bottom 0.406: v46.1,88.25 v29.64,88.25

### Text on the board
tPlace: 1 | Koltin Kosik-Harvey / March 7 / 2019 | PATA Sequencer / Breakout / TOP | A | H | A | H